# EAGLE design kostka (EAGLE 9.2.2)
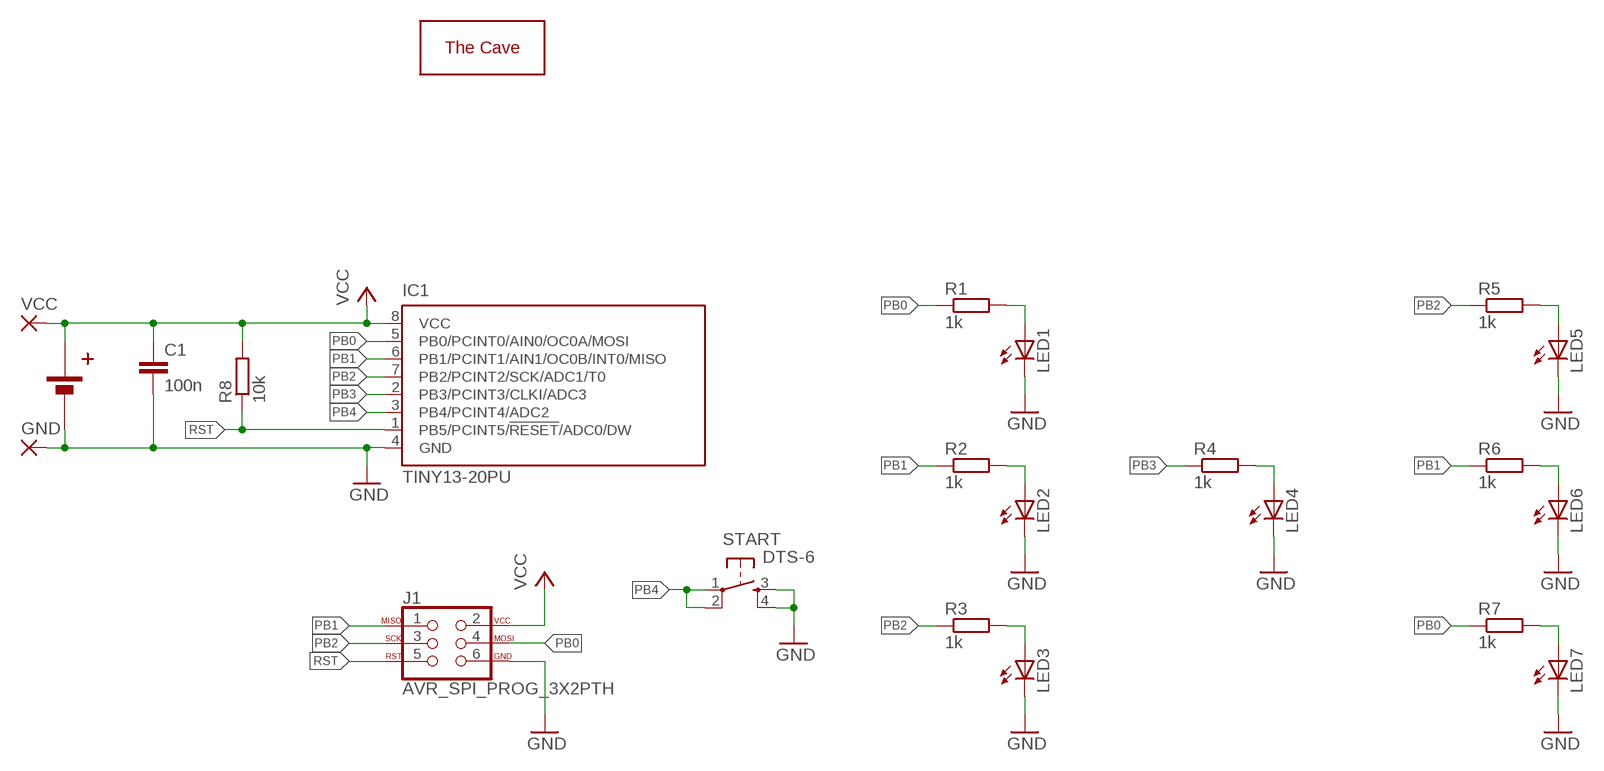
[diagram p0: schematic, sheet 1]

## Parts
C1  100n  C-EU025-025X050  [C025-025X050]
GND  WIREPADSMD1,27-254  [SMD1,27-2,54]
IC1  TINY13-20PU  [DIL08]
J1  AVR_SPI_PROG_3X2PTH  [2X3]
LED1  LED5MM  [LED5MM]
LED2  LED5MM  [LED5MM]
LED3  LED5MM  [LED5MM]
LED4  LED5MM  [LED5MM]
LED5  LED5MM  [LED5MM]
LED6  LED5MM  [LED5MM]
LED7  LED5MM  [LED5MM]
R1  1k  R-EU_0207/7  [0207/7]
R2  1k  R-EU_0207/7  [0207/7]
R3  1k  R-EU_0207/7  [0207/7]
R4  1k  R-EU_0207/7  [0207/7]
R5  1k  R-EU_0207/7  [0207/7]
R6  1k  R-EU_0207/7  [0207/7]
R7  1k  R-EU_0207/7  [0207/7]
R8  10k  R-EU_0207/7  [0207/7]
START  DTS-6  [DTS-6]
U$1  THECAVE_LOGO_NEW_BOTTOM  [NEW_LOGO_BOTTOM]
VCC  WIREPADSMD1,27-254  [SMD1,27-2,54]
X1  CR2032H_HOLD2  [CR2032HZ]

## Nets
GND: C1.2 GND.1(P) IC1.4(GND) J1.6 LED1.K(C) LED2.K(C) LED3.K(C) LED4.K(C) LED5.K(C) LED6.K(C) LED7.K(C) START.3 START.4 X1.MINUS(GND)
N$2: LED5.A R5.2
N$4: LED6.A R6.2
N$6: LED7.A R7.2
N$8: LED4.A R4.2
N$10: LED3.A R3.2
N$12: LED2.A R2.2
N$14: LED1.A R1.2
PB0: IC1.5(PB0/PCINT0/AIN0/OC0A/MOSI) J1.4 R1.1 R7.1
PB1: IC1.6(PB1/PCINT1/AIN1/OC0B/INT0/MISO) J1.1 R2.1 R6.1
PB2: IC1.7(PB2/PCINT2/SCK/ADC1/T0) J1.3 R3.1 R5.1
PB3: IC1.2(PB3/PCINT3/CLKI/ADC3) R4.1
PB4: IC1.3(PB4/PCINT4/ADC2) START.1 START.2
RST: IC1.1(PB5/PCINT5/!RESET!/ADC0/DW) J1.5 R8.1
VCC: C1.1 IC1.8(VCC) J1.2 R8.2 VCC.1(P) X1.PLUS(VCC)

## Library data of the parts
C1 = rcl:C-EU: CAPACITOR, European symbol; SPICEPREFIX: C
GND VCC = wirepad:WIREPAD: Wire PAD connect wire on PCB
IC1 = atmel:TINY13: 8-bit AVR Microcontroller with 1K Bytes In-System Programmable Flash Source: http://www.atmel.com/dyn/resources/prod_documents/2535S.pdf; MPN: ATTINY13-20PU; OC_FARNELL: 9171550; OC_NEWARK: 96K6521
J1 = SparkFun-Connectors:AVR_SPI_PROG_3X2: AVR ISP 6 Pin This is the reduced ISP connector for AVR programming. Common on Arduino. This footprint will take up less PCB space and can be used with a 10-pin to 6-pin adapter such as SKU: BOB-08508 **Special note about "TEST_POINT" package. The stop mask is on the top side, so if you want your programming test points to be on the bottom of your board, make sure to place this package on the bottom side of the board. This also ensure that the orientation to program from the bottom side will be correct. SparkFun Products: SparkFun ISP Pogo Adapter <https://www.sparkfun.com/products/11591> - NS Tiny AVR Programmer <https://www.sparkfun.com/products/11801> -PTH
LED1-LED7 = led:LED: LED OSRAM: - CHIPLED LG R971, LG N971, LY N971, LG Q971, LY Q971, LO R971, LY R971 LH N974, LH R974 LS Q976, LO Q976, LY Q976 LO Q996 - Hyper CHIPLED LW Q18S LB Q993, LB Q99A, LB R99A - SideLED LS A670, LO A670, LY A670, LG A670, LP A670 LB A673, LV A673, LT A673, LW A673 LH A674 LY A675 LS A676, LA A676, LO A676, LY A676, LW A676 LS A679, LY A679, LG A679 - Hyper Micro SIDELED® LS Y876, LA Y876, LO Y876, LY Y876 LT Y87S - SmartLED LW L88C, LW L88S LB L89C, LB L89S, LG L890 LS L89K, LO L89K, LY L89K LS L896, LA L896, LO L896, LY L896 - TOPLED LS T670, LO T670, LY T670, LG T670, LP T670 LSG T670, LSP T670, LSY T670, LOP T670, LYG T670 LG T671, LOG T671, LSG T671 LB T673, LV T673, LT T673, LW T673 LH T674 LS T676, LA T676, LO T676, LY T676, LB T676, LH T676, LSB T676, LW T676 LB T67C, LV T67C, LT T67C, LS T67K, LO T67K, LY T67K, LW E67C LS E67B, LA E67B, LO E67B, LY E67B, LB E67C, LV E67C, LT E67C LW T67C LS T679, LY T679, LG T679 LS T770, LO T770, LY T770, LG T770, LP T770 LB T773, LV T773, LT T773, LW T773 LH T774 LS E675, LA E675, LY E675, LS T675 LS T776, LA T776, LO T776, LY T776, LB T776 LHGB T686 LT T68C, LB T68C - Hyper Mini TOPLED® LB M676 - Mini TOPLED Santana® LG M470 LS M47K, LO M47K, LY M47K Source: http://www.osram.convergy.de LUXEON: - LUMILED® LXK2-PW12-R00, LXK2-PW12-S00, LXK2-PW14-U00, LXK2-PW14-V00 LXK2-PM12-R00, LXK2-PM12-S00, LXK2-PM14-U00 LXK2-PE12-Q00, LXK2-PE12-R00, LXK2-PE12-S00, LXK2-PE14-T00, LXK2-PE14-U00 LXK2-PB12-K00, LXK2-PB12-L00, LXK2-PB12-M00, LXK2-PB14-N00, LXK2-PB14-P00, LXK2-PB14-Q00 LXK2-PR12-L00, LXK2-PR12-M00, LXK2-PR14-Q00, LXK2-PR14-R00 LXK2-PD12-Q00, LXK2-PD12-R00, LXK2-PD12-S00 LXK2-PH12-R00, LXK2-PH12-S00 LXK2-PL12-P00, LXK2-PL12-Q00, LXK2-PL12-R00 Source: www.luxeon.com KINGBRIGHT: KA-3528ASYC Source: www.kingbright.com
R1-R8 = rcl:R-EU_: RESISTOR, European symbol; SPICEPREFIX: R
START = switch-tact:DTS-6
U$1 = thecave:THECAVE_LOGO: The Cave DIY workshop logos thecave.cz
X1 = thecave:CR2032H: CR2032 battery holder SMD: https://www.gme.cz/drzak-baterie-do-dps-pro-cr2032-bc-2002 HOLD: https://www.gme.cz/drzak-baterie-do-dps-pro-cr2032-ch25-2032

## Board
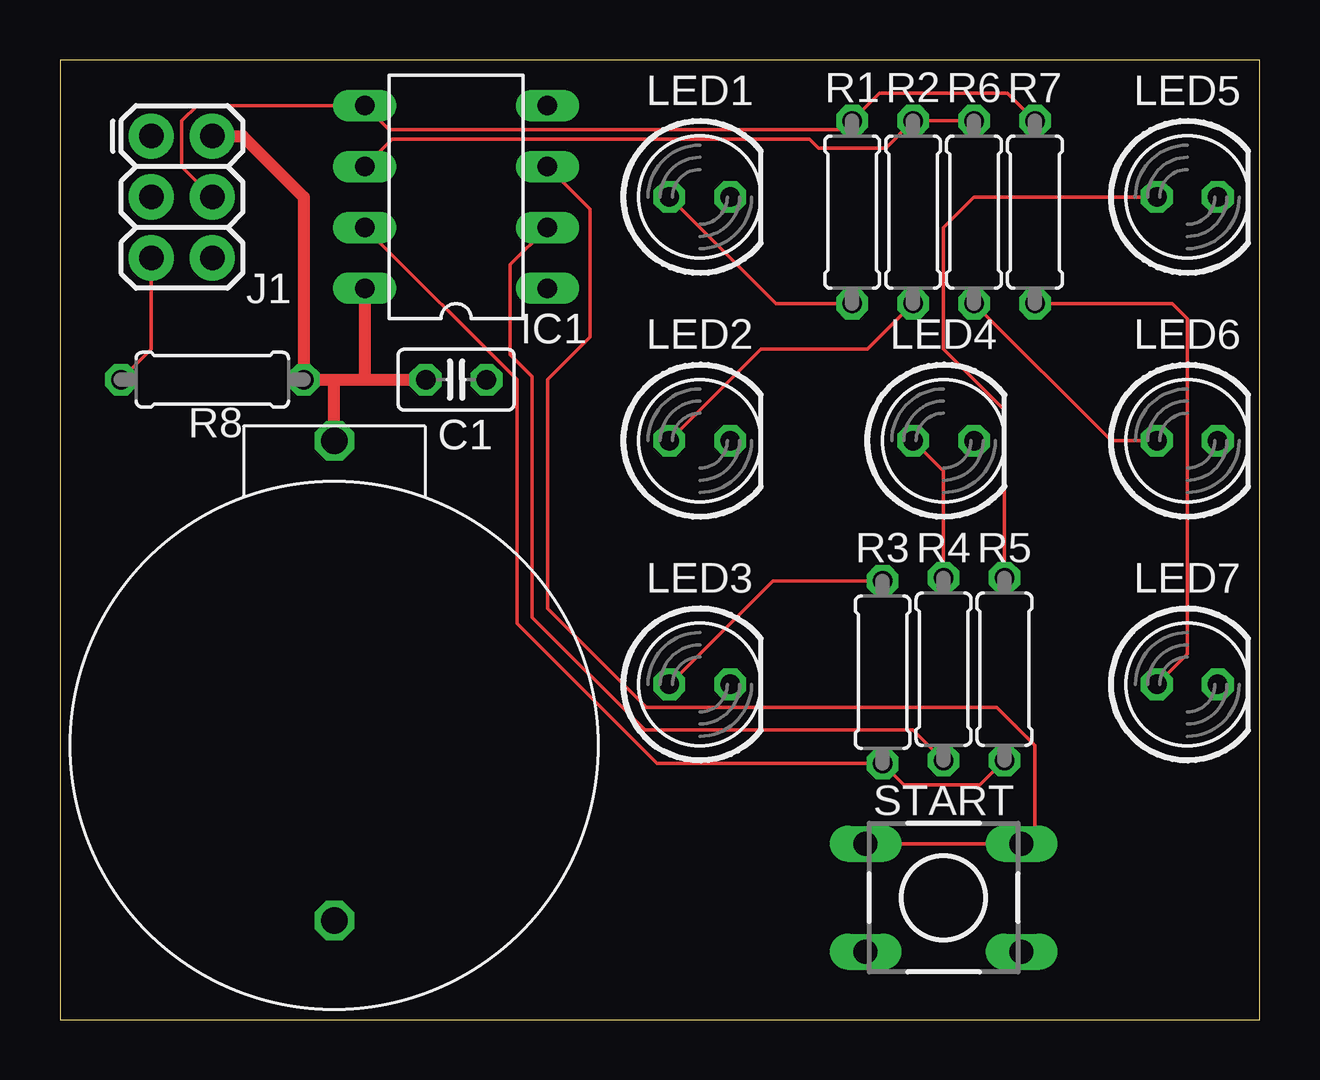
[diagram p1: board, top side]
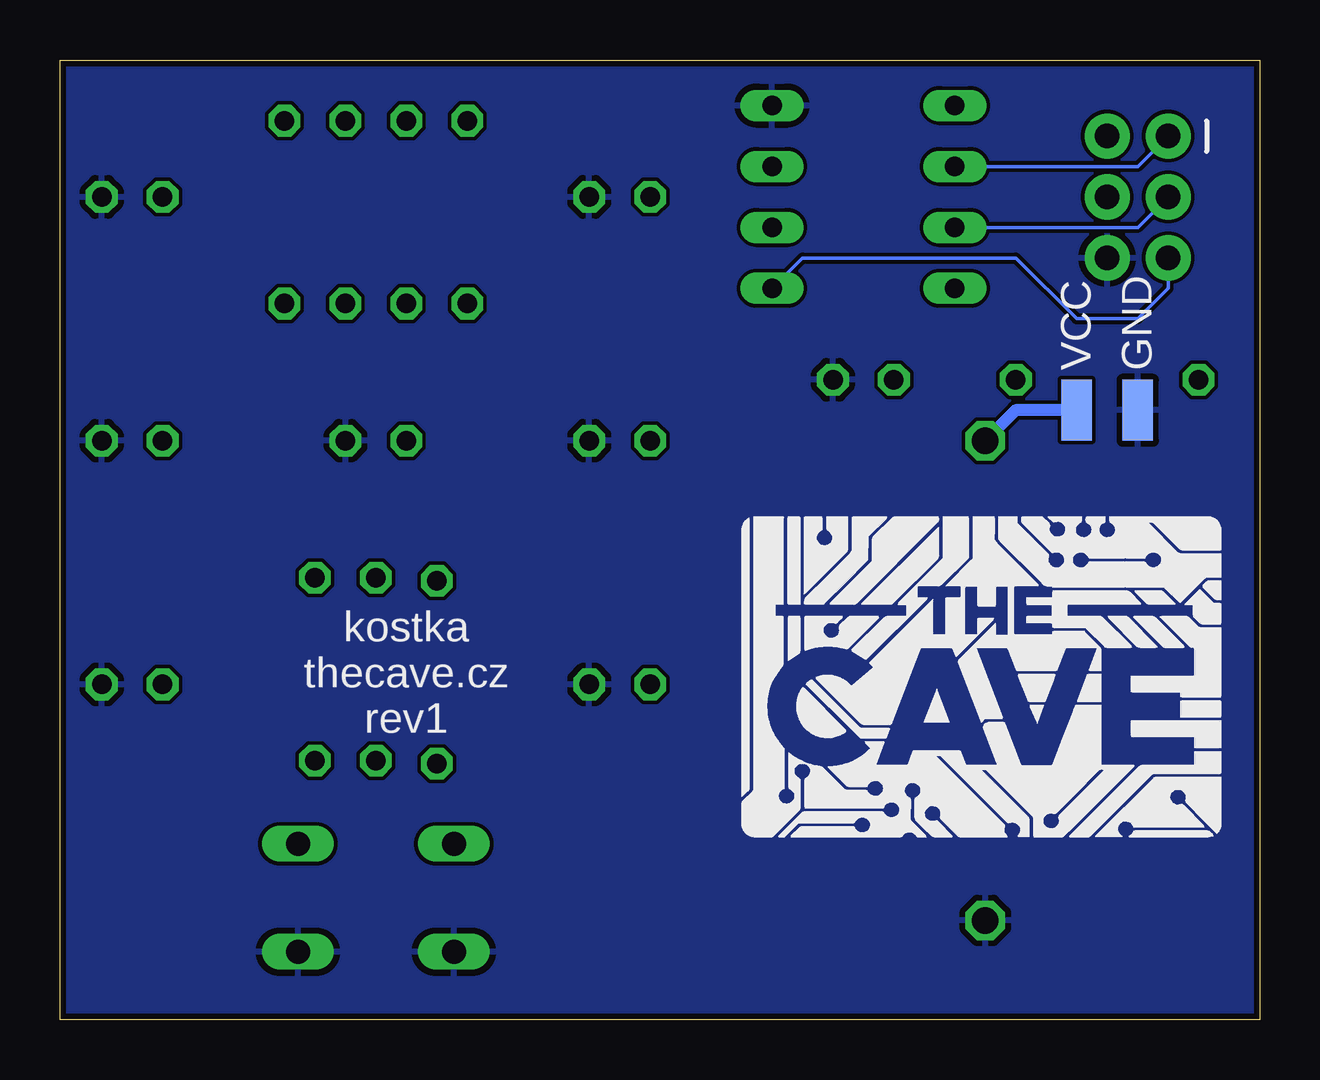
[diagram p2: board, bottom side, seen from below]

Size 50 x 40 mm. Coordinates in mm from the lower left corner, seen from the top.
Outline: 0,0 50,0 50,40 0,40 0,0
Copper layers (1*16): Top 0.035mm / dielectric 1.5mm / Bottom 0.035mm
Design rules "SeeedStudio_2layer_DRU_no_angle_20140221": minimum track width 6mil, minimum drill 12mil, track to track 6mil, track to pad 6mil, pad to pad 6mil, via to via 6mil, smd to smd 0mil, copper to edge 10mil, drill to drill 10mil, minimum pad ring 10mil, minimum via ring 6mil, stop-mask expansion 2mil, vias tented up to drill 100mil, thermal gap 10mil

### Footprints (pad centres in the part's own frame; a part is rotated, then mirrored left to right if it is on the bottom)
C025-025X050 = drill 0.813 octagon: 1 -1.27,0; 2 1.27,0
SMD1,27-2,54 = smd 1.27 x 2.54: 1 0,0
DIL08 = drill 0.813 long: 1 -3.81,-3.81; 2 -1.27,-3.81; 3 1.27,-3.81; 4 3.81,-3.81; 5 3.81,3.81; 6 1.27,3.81; 7 -1.27,3.81; 8 -3.81,3.81
2X3 = drill 1.016 pad 1.88: 1 0,0; 2 0,2.54; 3 2.54,0; 4 2.54,2.54; 5 5.08,0; 6 5.08,2.54
LED5MM = drill 0.813 octagon: A -1.27,0; K 1.27,0
0207/7 = drill 0.813 octagon: 1 -3.81,0; 2 3.81,0
DTS-6 = drill 1 long: 1 -3.25,2.25; 2 3.25,2.25; 3 -3.25,-2.25; 4 3.25,-2.25
CR2032HZ = drill 1.1 octagon: MINUS 0,7.3; PLUS 0,-12.7

### Placement (x,y rotation side)
C1  16.51,26.67 0 top
GND  5.08,25.4 0 bottom
IC1  16.51,34.29 90 top
J1  3.81,36.83 270 top
LED1  26.67,34.29 0 top
LED2  26.67,24.13 0 top
LED3  26.67,13.97 0 top
LED4  36.83,24.13 0 top
LED5  46.99,34.29 0 top
LED6  46.99,24.13 0 top
LED7  46.99,13.97 0 top
R1  33.02,33.66 270 top
R2  35.56,33.66 270 top
R3  34.29,14.48 90 top
R4  36.83,14.61 90 top
R5  39.37,14.61 90 top
R6  38.1,33.66 270 top
R7  40.64,33.66 270 top
R8  6.35,26.67 0 top
START  36.83,5.08 0 top
U$1  1.27,7.62 0 top
VCC  7.62,25.4 0 bottom
X1  11.43,11.43 180 top

### Tracks (layer width: path | path; a pad name or v marks a point on that pad's centre or on a via)
GND
  pour Bottom: 0,0 50.04,0 50.04,40.01 0,40.01
N$2
  Top 0.152: R5.2 39.37,25.4 36.83,27.94 36.83,33.02 38.1,34.29 LED5.A
N$4
  Top 0.152: R6.2 43.81,24.13 LED6.A
N$6
  Top 0.152: LED7.A 46.99,15.24 46.99,29.21 46.35,29.84 R7.2
N$8
  Top 0.152: LED4.A 36.83,22.86 R4.2
N$10
  Top 0.152: R3.2 29.72,18.29 LED3.A
N$12
  Top 0.152: LED2.A 29.21,27.94 33.66,27.94 R2.2
N$14
  Top 0.152: R1.2 29.84,29.84 LED1.A
PB0
  Top 0.152: J1.4 5.08,35.56 5.08,37.47 5.71,38.1 IC1.5 13.72,37.08 32.64,37.08 R1.1 34.16,38.61 39.5,38.61 R7.1
PB1
  Top 0.152: IC1.6 13.84,36.7 31.24,36.7 31.62,36.32 34.42,36.32 R2.1 R6.1
  Bottom 0.152: J1.1 5.08,35.56 IC1.6
PB2
  Top 0.152: IC1.7 19.05,26.67 19.05,16.51 24.89,10.67 R3.1 35.18,9.78 38.1,9.78 38.35,9.78 R5.1
  Bottom 0.152: J1.3 5.08,33.02 IC1.7
PB3
  Top 0.152: IC1.2 18.77,31.47 18.77,27.71 19.68,26.8 19.68,16.76 24.38,12.06 35.56,12.06 R4.1
PB4
  Top 0.152: IC1.3 22.1,33.78 22.1,28.45 20.32,26.67 20.32,17.14 24.45,13.02 39.05,13.02 40.64,11.43 40.64,7.62 40.37,7.62 START.2 START.1
RST
  Top 0.152: J1.5 3.81,27.94 R8.1
  Bottom 0.152: IC1.1 19.05,31.75 10.16,31.75 7.62,29.21 5.08,29.21 3.81,30.48 J1.5
VCC
  Top 0.508: 11.43,26.67 R8.2 10.16,34.29 7.62,36.83 J1.2 | 11.43,26.67 12.7,26.67 | 12.7,26.67 C1.1 | X1.PLUS 11.43,26.67 | IC1.8 12.7,26.67
  Bottom 0.508: VCC.1 10.16,25.4 X1.PLUS

### Text on the board
bPlace: kostka / thecave.cz / rev1